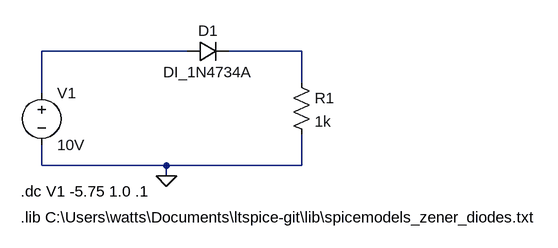
[diagram p0: schematic Diode_1N4734.asc]
Diode_1N4734.asc, the LTspice schematic file:
Version 4
SHEET 1 956 680
WIRE 256 112 32 112
WIRE 432 112 320 112
WIRE 432 160 432 112
WIRE 32 176 32 112
WIRE 32 288 32 256
WIRE 224 288 32 288
WIRE 432 288 432 240
WIRE 432 288 224 288
WIRE 224 304 224 288
FLAG 224 304 0
SYMBOL diode 256 128 R270
WINDOW 0 32 32 VTop 2
WINDOW 3 0 32 VBottom 2
SYMATTR InstName D1
SYMATTR Value DI_1N4734A
SYMATTR Prefix X
SYMBOL voltage 32 160 R0
SYMATTR InstName V1
SYMATTR Value 10V
SYMBOL res 416 144 R0
SYMATTR InstName R1
SYMATTR Value 1k
TEXT 0 328 Left 2 !.dc V1 -5.75 1.0 .1
TEXT 0 368 Left 2 !.lib C:\\Users\\watts\\Documents\\ltspice-git\\lib\\spicemodels_zener_diodes.txt

The netlist it stands for:
* Diode_1N4734.asc
XD1 N001 N002 DI_1N4734A  ; pins + -
V1 N001 0 10V
R1 N002 0 1k
.dc V1 -5.75 1.0 .1
.lib C:\Users\watts\Documents\ltspice-git\lib\spicemodels_zener_diodes.txt
.backanno
.end